# EAGLE design Trabajo (EAGLE 9.6.1)
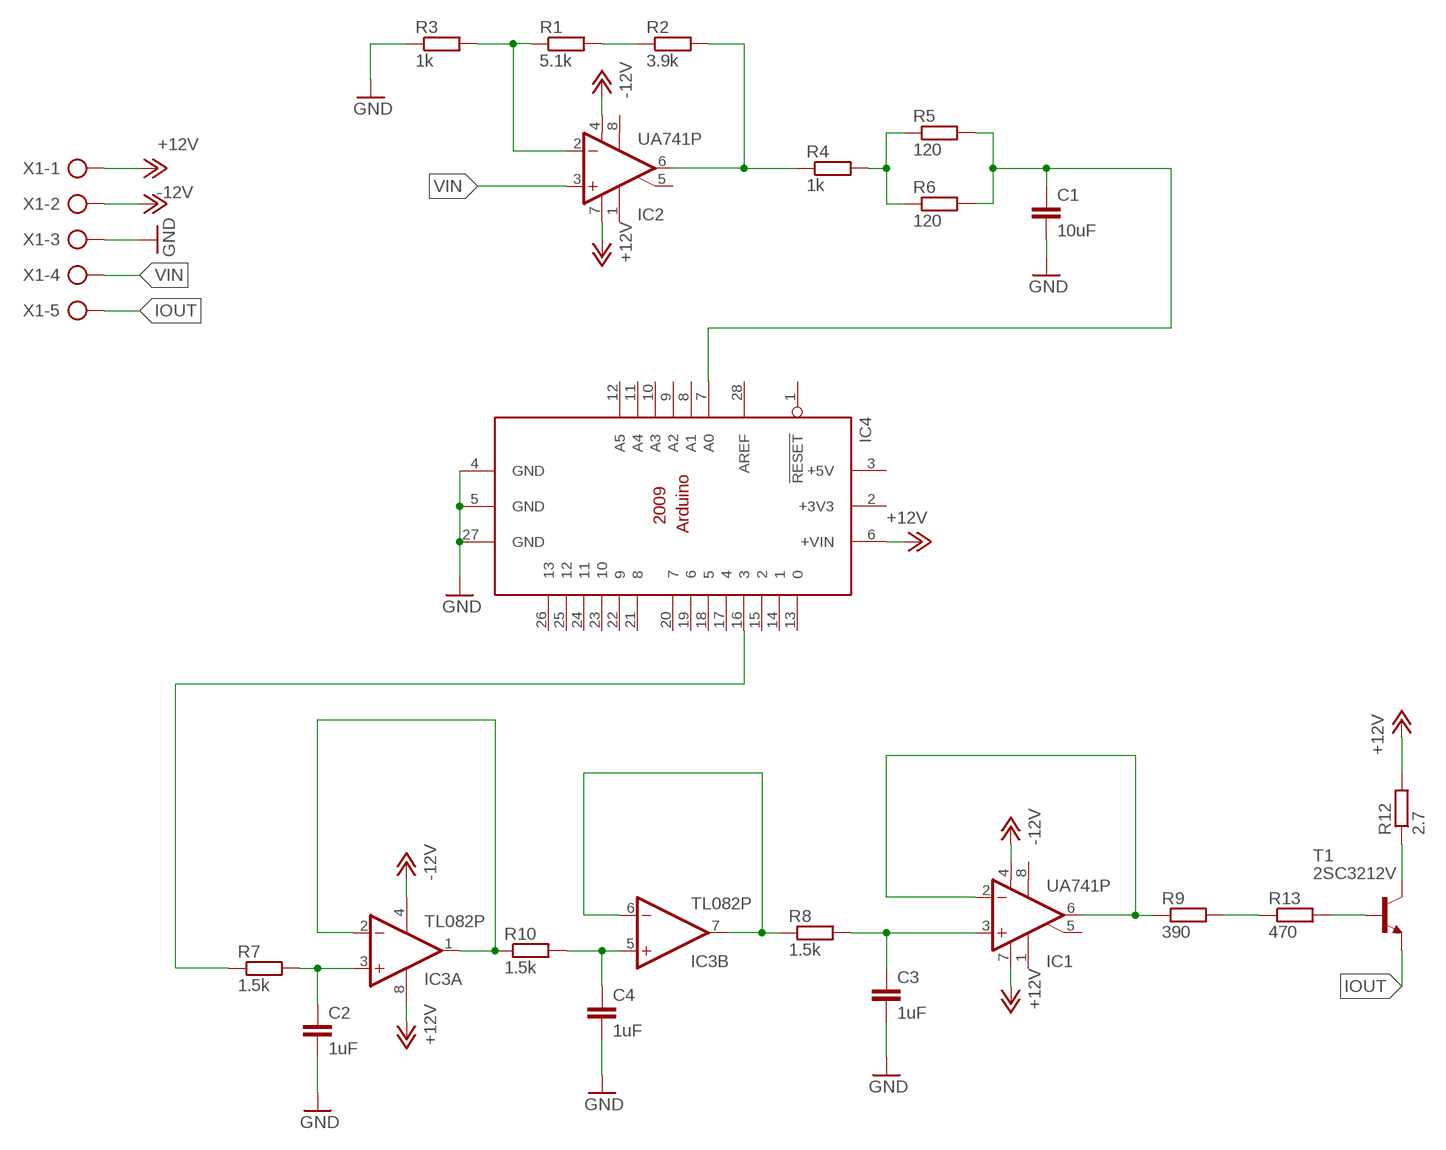
[diagram p0: schematic, sheet 1]

## Parts
C1  10uF  C-EU025-024X044  [C025-024X044]
C2  1uF  C-EU025-024X044  [C025-024X044]
C3  1uF  C-EU025-024X044  [C025-024X044]
C4  1uF  C-EU025-024X044  [C025-024X044]
IC1  UA741P  [DIL08]
IC2  UA741P  [DIL08]
IC3  TL082P  [DIL08]
IC4  ARDUINO2009_10  [ARDUINO2009]
R1  5.1k  R-EU_0204/7  [0204/7]
R2  3.9k  R-EU_0204/7  [0204/7]
R3  1k  R-EU_0204/7  [0204/7]
R4  1k  R-EU_0204/7  [0204/7]
R5  120  R-EU_0204/7  [0204/7]
R6  120  R-EU_0204/7  [0204/7]
R7  1.5k  R-EU_0204/7  [0204/7]
R8  1.5k  R-EU_0204/7  [0204/7]
R9  390  R-EU_0204/7  [0204/7]
R10  1.5k  R-EU_0204/7  [0204/7]
R12  2.7  R-EU_0204/7  [0204/7]
R13  470  R-EU_0204/7  [0204/7]
T1  2SC3212V  [TO220AV]
X1  AK300/5  [AK300/5]

## Nets
+12V: IC1.7(V+) IC2.7(V+) IC3.8(P:V+) IC4.6(+VIN) R12.2 X1.1
-12V: IC1.4(V-) IC2.4(V-) IC3.4(P:V-) X1.2
GND: C1.2 C2.2 C3.2 C4.2 IC4.4(GND) IC4.5(GND) IC4.27(GND) R3.1 X1.3
IOUT: T1.3(E) X1.5
N$1: IC2.2(-IN) R1.1 R3.2
N$2: R4.2 R5.1 R6.1
N$3: R1.2 R2.1
N$4: IC2.6(OUT) R2.2 R4.1
N$5: IC3.1(A:OUT) IC3.2(A:-IN) R10.1
N$6: C2.1 IC3.3(A:+IN) R7.2
N$8: C4.1 IC3.5(B:+IN) R10.2
N$9: IC3.6(B:-IN) IC3.7(B:OUT) R8.1
N$10: C3.1 IC1.3(+IN) R8.2
N$11: IC1.2(-IN) IC1.6(OUT) R9.1
N$12: R12.1 T1.2(C)
N$13: R13.2 T1.1(B)
N$14: R9.2 R13.1
VIN: IC2.3(+IN) X1.4
VIN2: IC4.16 R7.1
VOUT: C1.1 IC4.7(A0) R5.2 R6.2
Unconnected: IC1.1(ON1) IC1.5(ON2) IC1.8(OPT) IC2.1(ON1) IC2.5(ON2) IC2.8(OPT) IC4.1(!RESET) IC4.8(A1) IC4.9(A2) IC4.10(A3) IC4.11(A4) IC4.12(A5) IC4.13 IC4.14 IC4.15 IC4.17 IC4.18 IC4.19 IC4.20 IC4.21 IC4.22 IC4.23 IC4.24 IC4.25 IC4.26 IC4.28(AREF)

## Power pins joined to a net without a drawn wire
+3V3: IC4.2(+3V3)
+5V: IC4.3(+5V)

## Library data of the parts
C1-C4 = rcl:C-EU: CAPACITOR, European symbol; SPICEPREFIX: C
IC1 IC2 = linear:*741: OP AMP
IC3 = linear:TL082: OP AMP Data sheet <http://www.ti.com/lit/ds/symlink/tl084a . pdf>; DATA_SHEET: <a href="http://www.ti.com/lit/ds/symlink/tl084a.pdf"> Data sheet </a>
IC4 = arduino:ARDUINO2009_1: The Arduino Duemilanove ("2009") is a microcontroller board based on the ATmega168 or ATmega328. - 14 digital input/output pins (of which 6 can be used as PWM outputs) - 6 analog inputs, a 16 MHz crystal oscillator - USB connection - power jack - ISP header - reset button It contains everything needed to support the microcontroller; simply connect it to a computer with a USB cable or power it with a AC-to-DC adapter or battery to get started http://arduino.cc/en/Main/ArduinoBoardDuemilanove
R1-R10 R12 R13 = rcl:R-EU_: RESISTOR, European symbol; SPICEPREFIX: R
T1 = transistor-neu-to92:2SC3212: NPN Epitaxial Planar Trnasitor RF Power Amplifier Source: 2SC3212.pdf
X1 = con-ptr500:AK300/5: CONNECTOR; OC_FARNELL: unknown; OC_NEWARK: unknown

## Board
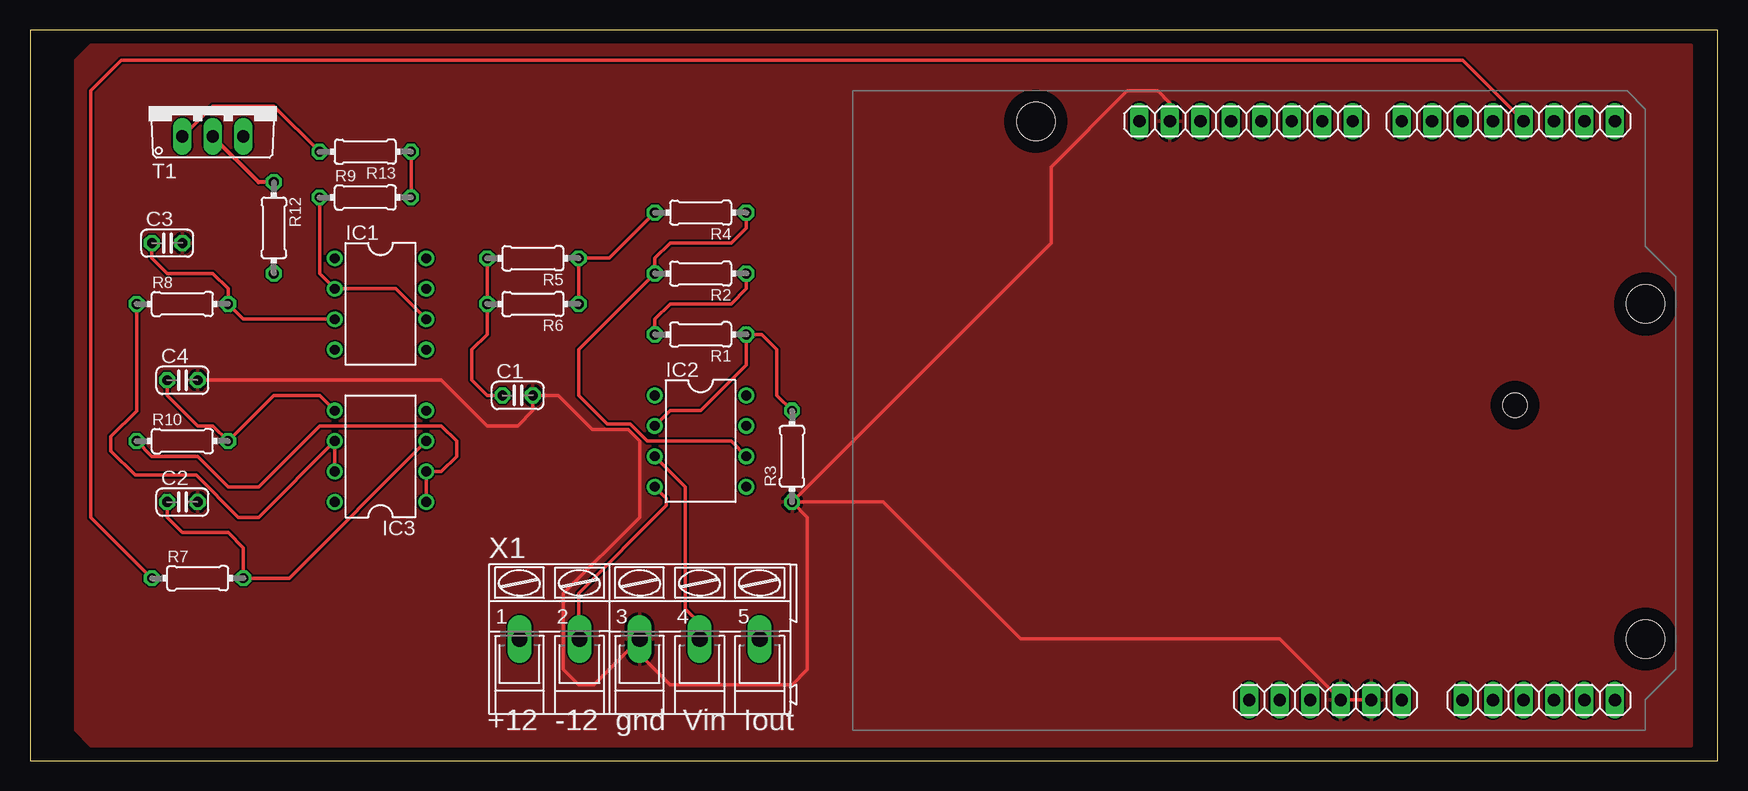
[diagram p1: board, top side]
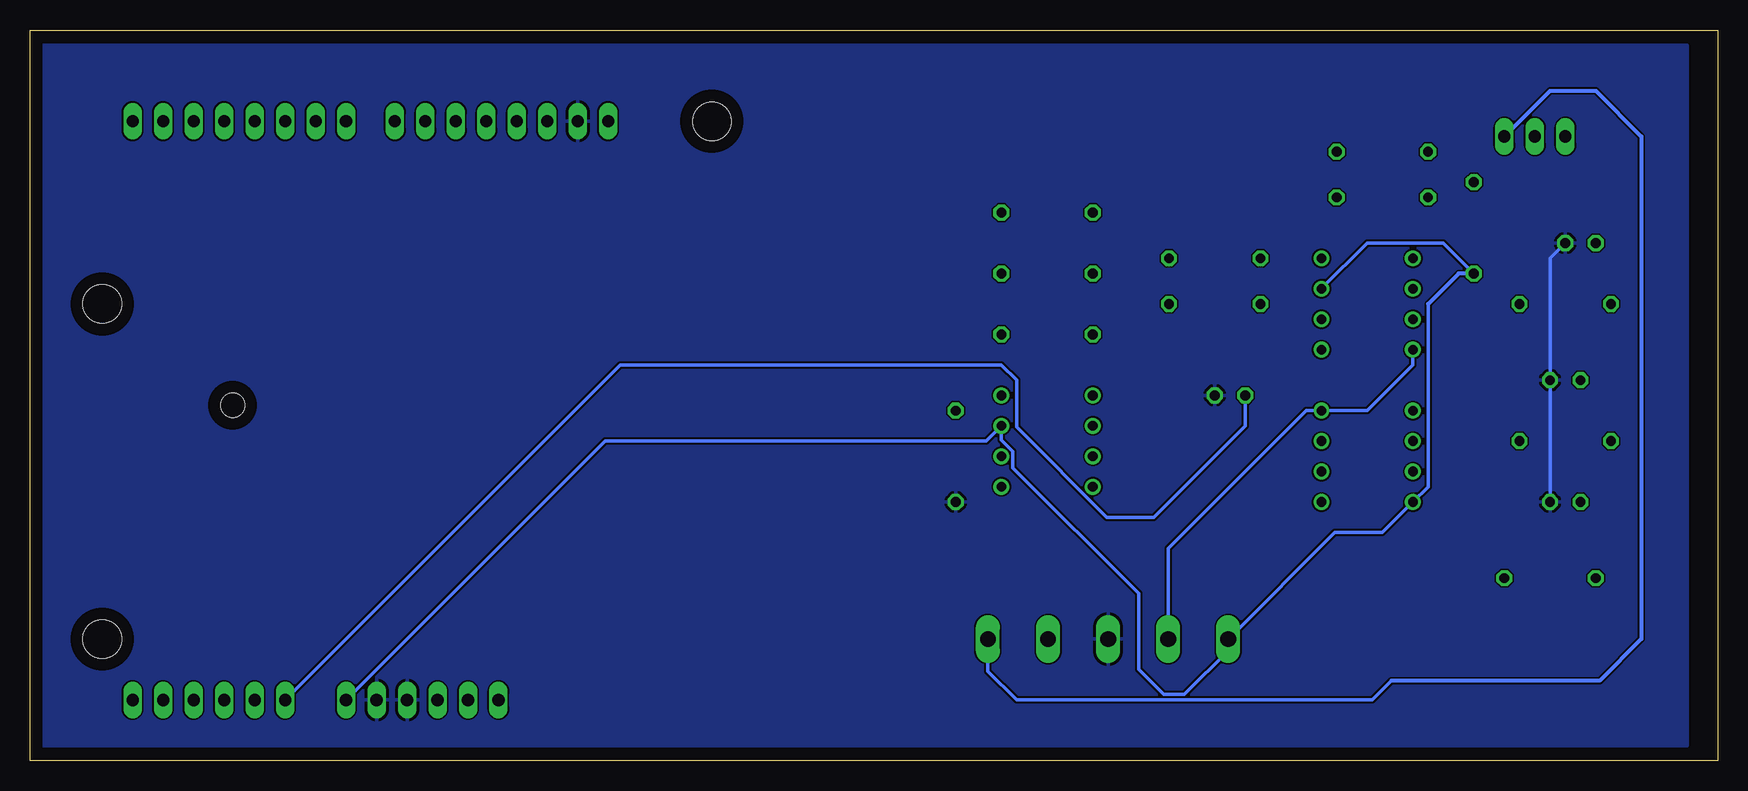
[diagram p2: board, bottom side, seen from below]

Size 140.64 x 60.95 mm. Coordinates in mm from the lower left corner, seen from the top.
Outline: 0,0 140.64,0 140.64,60.95 0,60.95 0,0
Copper layers (1*16): Top 0.035mm / dielectric 1.5mm / Bottom 0.035mm
Design rules "default": minimum track width 6mil, minimum drill 0.35mm, track to track 6mil, track to pad 6mil, pad to pad 6mil, via to via 6mil, smd to smd 6mil, copper to edge 40mil, drill to drill 6mil, minimum pad ring 10mil, minimum via ring 8mil, stop-mask expansion 4mil, vias tented up to drill 0mil, thermal gap 10mil

### Footprints (pad centres in the part's own frame; a part is rotated, then mirrored left to right if it is on the bottom)
C025-024X044 = drill 0.813 octagon: 1 -1.27,0; 2 1.27,0
DIL08 = drill 0.813 pad 1.27: 1 -3.81,-3.81; 2 -1.27,-3.81; 3 1.27,-3.81; 4 3.81,-3.81; 5 3.81,3.81; 6 1.27,3.81; 7 -1.27,3.81; 8 -3.81,3.81
ARDUINO2009 = drill 1.016 long: 1 33.02,2.54; 2 35.56,2.54; 3 38.1,2.54; 4 40.64,2.54; 5 43.18,2.54; 6 45.72,2.54; 7 50.8,2.54; 8 53.34,2.54; 9 55.88,2.54; 10 58.42,2.54; 11 60.96,2.54; 12 63.5,2.54; 13 63.5,50.8; 14 60.96,50.8; 15 58.42,50.8; 16 55.88,50.8; 17 53.34,50.8; 18 50.8,50.8; 19 48.26,50.8; 20 45.72,50.8; 21 41.656,50.8; 22 39.116,50.8; 23 36.576,50.8; 24 34.036,50.8; 25 31.496,50.8; 26 28.956,50.8; 27 26.416,50.8; 28 23.876,50.8 | hole 3.2: 15.24,50.8; 66.04,35.56; 66.04,7.62 | hole 2: 55.17,27.114
0204/7 = drill 0.813 octagon: 1 -3.81,0; 2 3.81,0
TO220AV = drill 1.016 long: 1 -2.54,-2.54; 2 0,-2.54; 3 2.54,-2.54
AK300/5 = drill 1.321 long: 1 -10.008,0; 2 -5.004,0; 3 0,0; 4 5.004,0; 5 10.008,0

### Placement (x,y rotation side)
C1  40.64,30.48 0 top
C2  12.7,21.59 0 top
C3  11.43,43.18 0 top
C4  12.7,31.75 0 top
IC1  29.21,38.1 270 top
IC2  55.88,26.67 270 top
IC3  29.21,25.4 90 top
IC4  68.58,2.54 0 top
R1  55.88,35.56 180 top
R2  55.88,40.64 180 top
R3  63.5,25.4 90 top
R4  55.88,45.72 180 top
R5  41.91,41.91 180 top
R6  41.91,38.1 180 top
R7  13.97,15.24 0 top
R8  12.7,38.1 0 top
R9  27.94,46.99 0 top
R10  12.7,26.67 0 top
R12  20.32,44.45 270 top
R13  27.94,50.8 180 top
T1  15.24,54.61 0 top
X1  50.8,10.16 0 top

### Tracks (layer width: path | path; a pad name or v marks a point on that pad's centre or on a via)
+12V
  Bottom 0.305: 24.13,38.1 24.13,22.86 IC3.8 27.94,19.05 31.9,19.05 40.72,10.24 | X1.1 40.72,10.24 | R12.2 22.86,43.18 29.21,43.18 IC1.7 | 40.72,10.24 40.72,9.27 44.45,5.54 46.18,5.54 48.26,7.62 48.26,13.97 58.72,24.43 58.72,25.8 59.69,26.77 IC2.7 60.96,26.67 92.71,26.67 IC4.6
  Bottom 0.318: R12.2 21.59,40.64 24.13,38.1
-12V
  Top 0.152: 45.72,10.24 X1.2
  Top 0.305: 45.72,10.24 45.72,13.97 53.03,21.29 53.03,21.89 IC2.4
  Bottom 0.305: X1.2 45.8,17.7 34.29,29.21 IC3.4 29.21,29.21 25.4,33.02 IC1.4
GND
  Top 0.305: R3.1 64.77,20.32 64.77,7.62 63.5,6.35 53.34,6.35 50.8,8.89 X1.3 46.99,6.35 45.72,6.35 44.45,7.62 44.45,13.97 50.8,20.32 50.8,26.67 49.83,27.63 46.86,27.63 44.02,30.48 C1.2 41.91,29.21 40.64,27.94 38.1,27.94 34.29,31.75 C4.2 | R3.1 85.09,43.18 85.09,49.53 91.44,55.88 93.98,55.88 95,54.86 IC4.27 | R3.1 71.12,21.59 82.55,10.16 104.14,10.16 IC4.4 IC4.5
  Bottom 0.305: C3.2 13.97,41.91 C4.2 C2.2
  pour Bottom: 2.54,59.69 2.54,1.27 139.7,1.27 139.7,59.69
  pour Top: 3.81,58.42 3.81,2.54 5.08,1.27 138.43,1.27 138.43,59.69 5.08,59.69
IOUT
  Bottom 0.305: 27.2,6.68 28.8,5.08 58.42,5.08 60.81,7.47 X1.5
  Bottom 0.318: T1.3 13.97,55.88 10.16,55.88 6.35,52.07 6.35,10.16 9.83,6.68 27.2,6.68
N$1
  Top 0.305: R3.2 62.23,30.48 62.23,34.29 60.96,35.56 R1.1 59.69,33.02 55.88,29.21 53.34,29.21 IC2.2
N$2
  Top 0.305: R4.2 48.26,41.91 R5.1 R6.1
N$3
  Top 0.305: R2.1 59.69,39.37 58.42,38.1 53.34,38.1 52.07,36.83 R1.2
N$4
  Top 0.305: R4.1 59.69,44.45 58.42,43.18 53.34,43.18 52.07,41.91 R2.2 45.72,34.29 45.72,30.48 48.11,28.09 50.02,28.09 51.45,26.67 58.42,26.67 IC2.6
N$5
  Top 0.305: IC3.1 IC3.2 34.29,24.13 35.56,25.4 35.56,26.67 34.29,27.94 24.13,27.94 19.05,22.86 16.51,22.86 13.97,25.4 10.16,25.4 R10.1
N$6
  Top 0.305: C2.1 11.43,20.32 12.7,19.05 16.51,19.05 17.78,17.78 R7.2 21.59,15.24 IC3.3
N$8
  Top 0.305: C4.1 11.43,30.48 13.97,27.94 15.24,27.94 R10.2 20.32,30.48 24.13,30.48 IC3.5
N$9
  Top 0.305: IC3.7 IC3.6 19.05,20.32 17.35,20.32 13.84,23.82 8.76,23.82 6.73,25.86 6.73,27.04 8.89,29.2 R8.1
N$10
  Top 0.305: C3.1 10.16,41.91 11.43,40.64 15.24,40.64 16.51,39.37 R8.2 17.78,36.83 IC1.3
N$11
  Top 0.305: R9.1 24.13,40.64 IC1.2 30.48,39.37 IC1.6
N$12
  Top 0.318: R12.1 19.05,48.26 T1.2
N$13
  Top 0.305: R13.2 20.32,54.61 15.24,54.61 T1.1
N$14
  Top 0.305: R13.1 R9.2
VIN
  Top 0.152: 55.88,10.24 X1.4
  Top 0.305: 55.88,10.24 55.88,11.43 54.61,12.7 54.61,22.86 IC2.3
VIN2
  Top 0.305: R7.1 5.08,20.32 5.08,55.88 7.62,58.42 119.38,58.42 IC4.16
VOUT
  Top 0.305: R5.2 R6.2 38.1,35.56 36.83,34.29 36.83,31.75 38.1,30.48 C1.1
  Bottom 0.305: C1.1 39.37,27.94 46.99,20.32 50.89,20.32 58.42,27.84 58.42,31.75 59.69,33.02 91.44,33.02 IC4.7

### Text on the board
tPlace: +12 -12 gnd Vin Iout